# Altium project SOT-223,0606,0603.PrjPcb
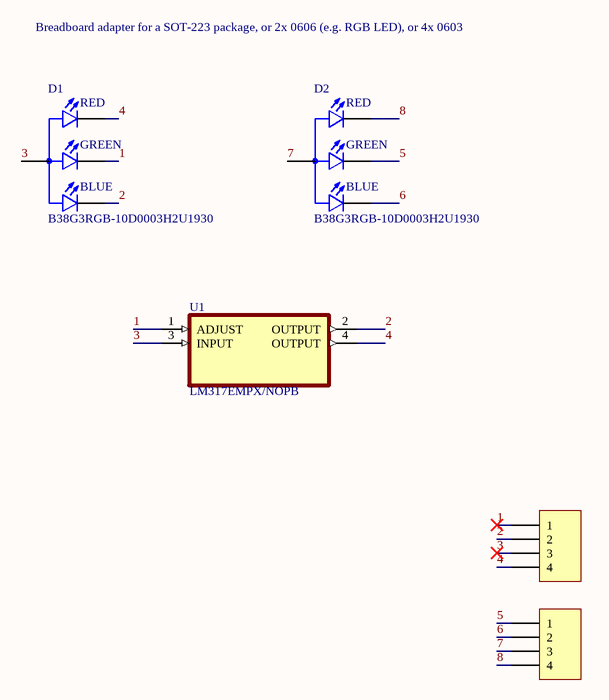
[diagram p0: Schematic.SchDoc]
1 sheet, 5 parts. Net scope: global (net labels, ports and power ports of the same name join across sheets).
Board file: PCB.PcbDoc

## Sheet Schematic.SchDoc
size A4

### Parts
D1  B38G3RGB-10D0003H2U1930  [LED_B38G3RGB-10D0003H2U1930]
D2  B38G3RGB-10D0003H2U1930  [LED_B38G3RGB-10D0003H2U1930]
P1  Header 4  [HDR1X4]  (value not drawn)
P2  Header 4  [HDR1X4]  (value not drawn)
U1  LM317EMPX/NOPB  [SOT230P700X180-4N]

### Nets
1: D1.1(G_C) P1.1 U1.1(ADJUST)
2: D1.2(B_C) P1.2 U1.2(OUTPUT)
3: D1.3(A) P1.3 U1.3(INPUT)
4: D1.4(R_C) P1.4 U1.4(OUTPUT)
5: D2.1(G_C) P2.1
6: D2.2(B_C) P2.2
7: D2.3(A) P2.3
8: D2.4(R_C) P2.4

### Notes on the sheet
- Breadboard adapter for a SOT-223 package, or 2x 0606 (e.g. RGB LED), or 4x 0603
- (in symbol B38G3RGB-10D0003H2U1930) RED; GREEN; BLUE

### Library data of the parts
D1 D2 = B38G3RGB-10D0003H2U1930: Red, Green, Blue (RGB) - LED Indication - Discrete 2V Red, 3V Green, 3V Blue 0606 (1616 Metric); MF: Harvatek Corporation; Price: None; Purchase-URL: https://pricing.snapeda.com/search/part/B38G3RGB-10D0003H2U1930/?ref=eda; SnapEDA_Link: https://www.snapeda.com/parts/B38G3RGB-10D0003H2U1930/Harvatek/view-part/?ref=snap; Availability: In Stock; Value: *; MP: B38G3RGB-10D0003H2U1930; Package: None; Check_prices: https://www.snapeda.com/parts/B38G3RGB-10D0003H2U1930/Harvatek/view-part/?ref=eda
P1 P2 = Header 4: Header, 4-Pin; LatestRevisionDate: 17-Jul-2002; LatestRevisionNote: Re-released for DXP Platform.; Publisher: Altium Limited
U1 = LM317EMPX/NOPB: 1.5-A, 40-V, adjustable linear voltage regulator 4-SOT-223 0 to 125; MF: Texas Instruments; MP: LM317EMPX/NOPB; Value: *; SnapEDA_Link: https://www.snapeda.com/parts/LM317EMPX/NOPB/Texas%20Instruments/view-part/425399/?ref=snap; Price: None; Availability: Unavailable; Texas_Instruments-Purchase-URL: https://snapeda.com/shop?store=Texas+Instruments&id=425399; Package: SOT-223-4 Texas Instruments